# EAGLE design SenseGrain-v0.2 (EAGLE 7.2.0)
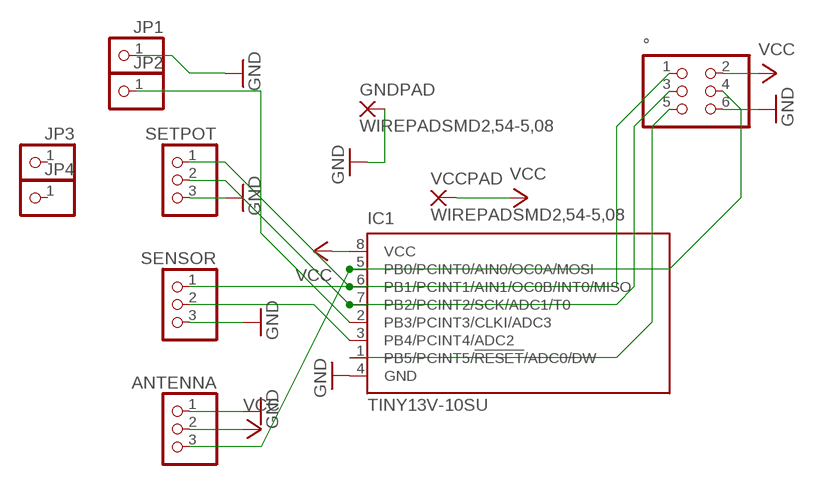
[diagram p0: schematic, sheet 1]

## Parts
ANTENNA  PINHD-1X3CB  [1X03-CLEANBIG]
GNDPAD  WIREPADSMD2,54-5,08  [SMD2,54-5,08]
IC1  TINY13V-10SU  [8S2]
JP1  PINHD-1X1  [1X01]
JP2  PINHD-1X1  [1X01]
JP3  PINHD-1X1  [1X01]
JP4  PINHD-1X1  [1X01]
SENSOR  PINHD-1X3CB  [1X03-CLEANBIG]
SETPOT  PINHD-1X3CB  [1X03-CLEANBIG]
VCCPAD  WIREPADSMD2,54-5,08  [SMD2,54-5,08]
°  PINHD-2X3  [2X03]

## Nets
GND: ANTENNA.1 GNDPAD.1(P) IC1.4(GND) JP1.1 SENSOR.3 SETPOT.3 °.6
N$1: IC1.6(PB1/PCINT1/AIN1/OC0B/INT0/MISO) SENSOR.1 SETPOT.1 °.1
N$2: ANTENNA.3 IC1.5(PB0/PCINT0/AIN0/OC0A/MOSI) °.4
N$4: IC1.3(PB4/PCINT4/ADC2) SENSOR.2
N$6: IC1.2(PB3/PCINT3/CLKI/ADC3) JP2.1
N$7: IC1.1(PB5/PCINT5/!RESET!/ADC0/DW) °.5
N$8: IC1.7(PB2/PCINT2/SCK/ADC1/T0) SETPOT.2 °.3
VCC: ANTENNA.2 IC1.8(VCC) VCCPAD.1(P) °.2
Unconnected: JP3.1 JP4.1

## Library data of the parts
ANTENNA SENSOR SETPOT = adafruit:PINHD-1X3: PIN HEADER
GNDPAD VCCPAD = wirepad:WIREPAD: Wire PAD connect wire on PCB
IC1 = atmel:TINY13: 8-bit AVR Microcontroller with 1K Bytes In-System Programmable Flash Source: http://www.atmel.com/dyn/resources/prod_documents/2535S.pdf; MPN: ATTINY13V-10SU; OC_FARNELL: 9171584; OC_NEWARK: 96K6524
JP1-JP4 = pinhead:PINHD-1X1: PIN HEADER
° = pinhead:PINHD-2X3: PIN HEADER

## Net classes
0 default: width 0.254 mm, drill 0.508 mm, clearance 0.305 mm

## Board
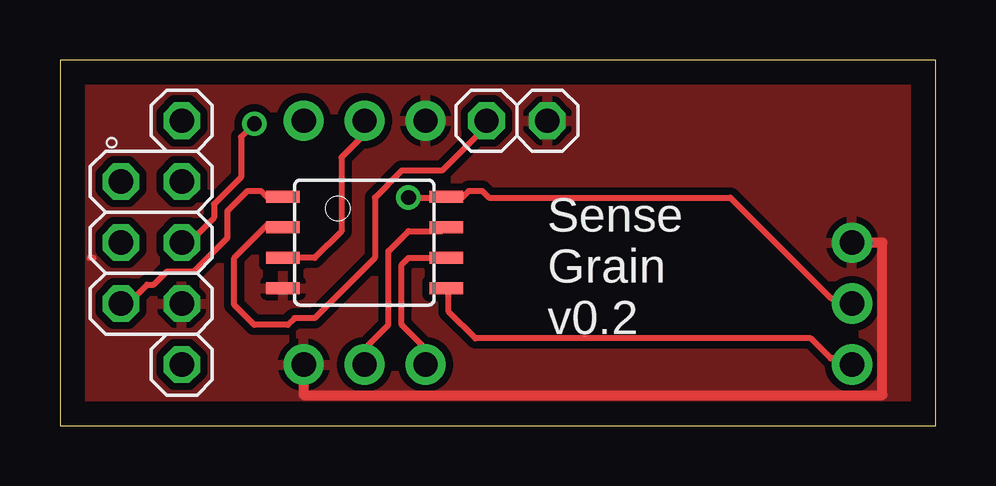
[diagram p1: board, top side]
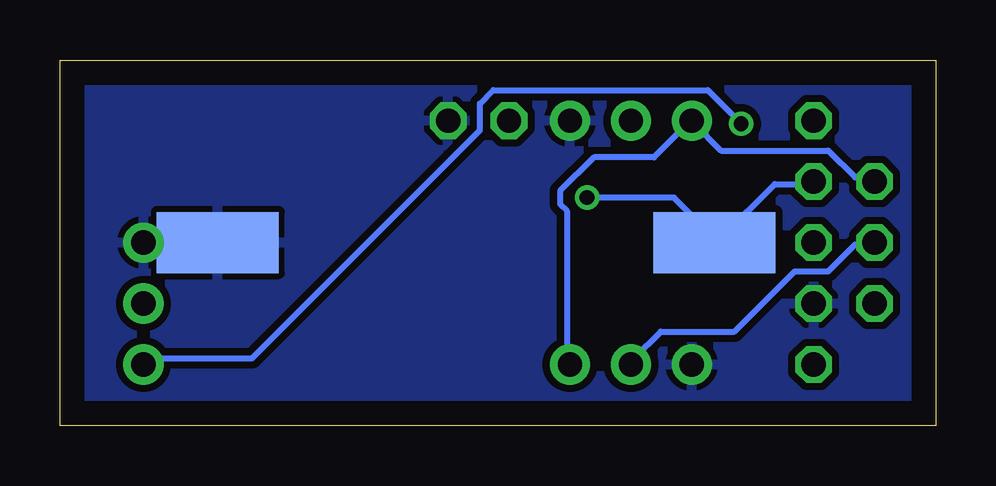
[diagram p2: board, bottom side, seen from below]

Size 36.5 x 15.23 mm. Coordinates in mm from the lower left corner, seen from the top.
Outline: 0,0 36.5,0 36.5,15.23 0,15.23 0,0
Copper layers (1*16): Top 0.035mm / dielectric 1.5mm / Bottom 0.035mm
Design rules "default": minimum track width 10mil, minimum drill 24mil, track to track 8mil, track to pad 8mil, pad to pad 8mil, via to via 8mil, smd to smd 8mil, copper to edge 40mil, drill to drill 8mil, minimum pad ring 10mil, minimum via ring 8mil, stop-mask expansion 4mil, vias tented up to drill 0mil, thermal gap 10mil

### Footprints (pad centres in the part's own frame; a part is rotated, then mirrored left to right if it is on the bottom)
1X03-CLEANBIG = drill 1.016 pad 1.676: 1 -2.54,0; 2 0,0; 3 2.54,0
SMD2,54-5,08 = smd 2.54 x 5.08: 1 0,0
8S2 = smd 0.5 x 1.4: 1 -1.905,-3.404; 2 -0.645,-3.404; 3 0.625,-3.404; 4 1.895,-3.404; 5 1.905,3.404; 6 0.635,3.404; 7 -0.635,3.404; 8 -1.905,3.404
1X01 = drill 1.016 octagon: 1 0,0
2X03 = drill 1.016 octagon: 1 -2.54,-1.27; 2 -2.54,1.27; 3 0,-1.27; 4 0,1.27; 5 2.54,-1.27; 6 2.54,1.27

### Placement (x,y rotation side)
ANTENNA  33.02,5.08 270 top
GNDPAD  29.92,7.62 270 bottom
IC1  12.7,7.62 270 top
JP1  20.32,12.7 0 top
JP2  17.78,12.7 0 top
JP3  5.08,12.7 0 top
JP5  [1X01]  5.08,2.54 0 top
SENSOR  12.7,12.7 0 top
SETPOT  12.7,2.54 180 top
VCCPAD  9.22,7.62 270 bottom
°  3.81,7.62 270 top

### Tracks (layer width: path | path; a pad name or v marks a point on that pad's centre or on a via)
GND
  Top 0.254: 1.4,6.99 1.22,6.99
  Top 0.406: SETPOT.3 10.16,1.27 34.29,1.27 34.29,7.62 ANTENNA.1
  pour Top: 0,15.24 0,0 36.83,0 36.83,15.24
  pour Bottom: 0,15.24 0,0 36.83,0 36.83,15.24
N$1
  Top 0.254: IC1.6 14.53,6.99 14.25,6.71 14.25,4.19 15.09,3.35 15.09,2.79 SETPOT.1
  Bottom 0.254: °.1 2.79,10.34 3.35,10.34 4.47,11.46 8.94,11.46 10.06,12.57 SENSOR.1 10.34,12.57 11.73,11.18 14.25,11.18 15.65,9.78 15.65,9.22 15.37,8.94 15.37,2.79 SETPOT.1
N$2  (via drill 0.61)
  Top 0.254: IC1.5 16.2,5.59 16.2,4.75 17.32,3.63 31.29,3.63 32.13,2.79 32.97,2.79 ANTENNA.3 | v8.1,12.57 7.54,12.01 7.54,10.34 6.43,9.22 6.43,8.66 5.59,7.82 5.31,7.82 °.4
  Bottom 0.254: v8.1,12.57 9.5,13.97 18.44,13.97 19,13.41 19,12.29 28.5,2.79 32.97,2.79 ANTENNA.3
N$4
  Top 0.254: IC1.3 9.5,6.99 10.62,6.99 11.73,8.1 11.73,11.18 12.57,12.01 12.57,12.57 SENSOR.2
N$6
  Top 0.254: IC1.2 9.22,8.38 8.66,8.38 7.26,6.99 7.26,5.03 8.1,4.19 9.5,4.19 9.78,4.47 10.62,4.47 13.13,6.99 13.13,9.5 14.25,10.62 15.93,10.62 17.88,12.57 JP2.1
N$7
  Top 0.254: IC1.1 9.22,9.5 8.66,9.5 8.38,9.78 7.82,9.78 6.99,8.94 6.99,7.82 5.59,6.43 4.47,6.43 3.91,5.87 3.63,5.87 2.79,5.03 °.5
N$8
  Top 0.254: IC1.7 15.93,8.1 14.53,8.1 13.69,7.26 13.69,4.19 12.85,3.35 12.85,2.79 SETPOT.2
  Bottom 0.254: °.3 2.79,7.54 3.35,7.54 4.47,6.43 5.87,6.43 8.38,3.91 11.46,3.91 12.57,2.79 SETPOT.2
VCC  (via drill 0.61)
  Top 0.254: v14.53,9.5 15.93,9.5 IC1.8 16.2,9.5 16.76,9.5 17.04,9.78 17.6,9.78 17.88,9.5 27.94,9.5 32.13,5.31 32.97,5.31 ANTENNA.2
  Bottom 0.254: v14.53,9.5 10.9,9.5 9.22,7.82 VCCPAD.1 8.94,7.82 6.71,10.06 5.31,10.06 °.2

### Text on the board
tNames: Sense / Grain / v0.2